# EAGLE design Adafruit NeoPixel Shield v2 (EAGLE 6.4)
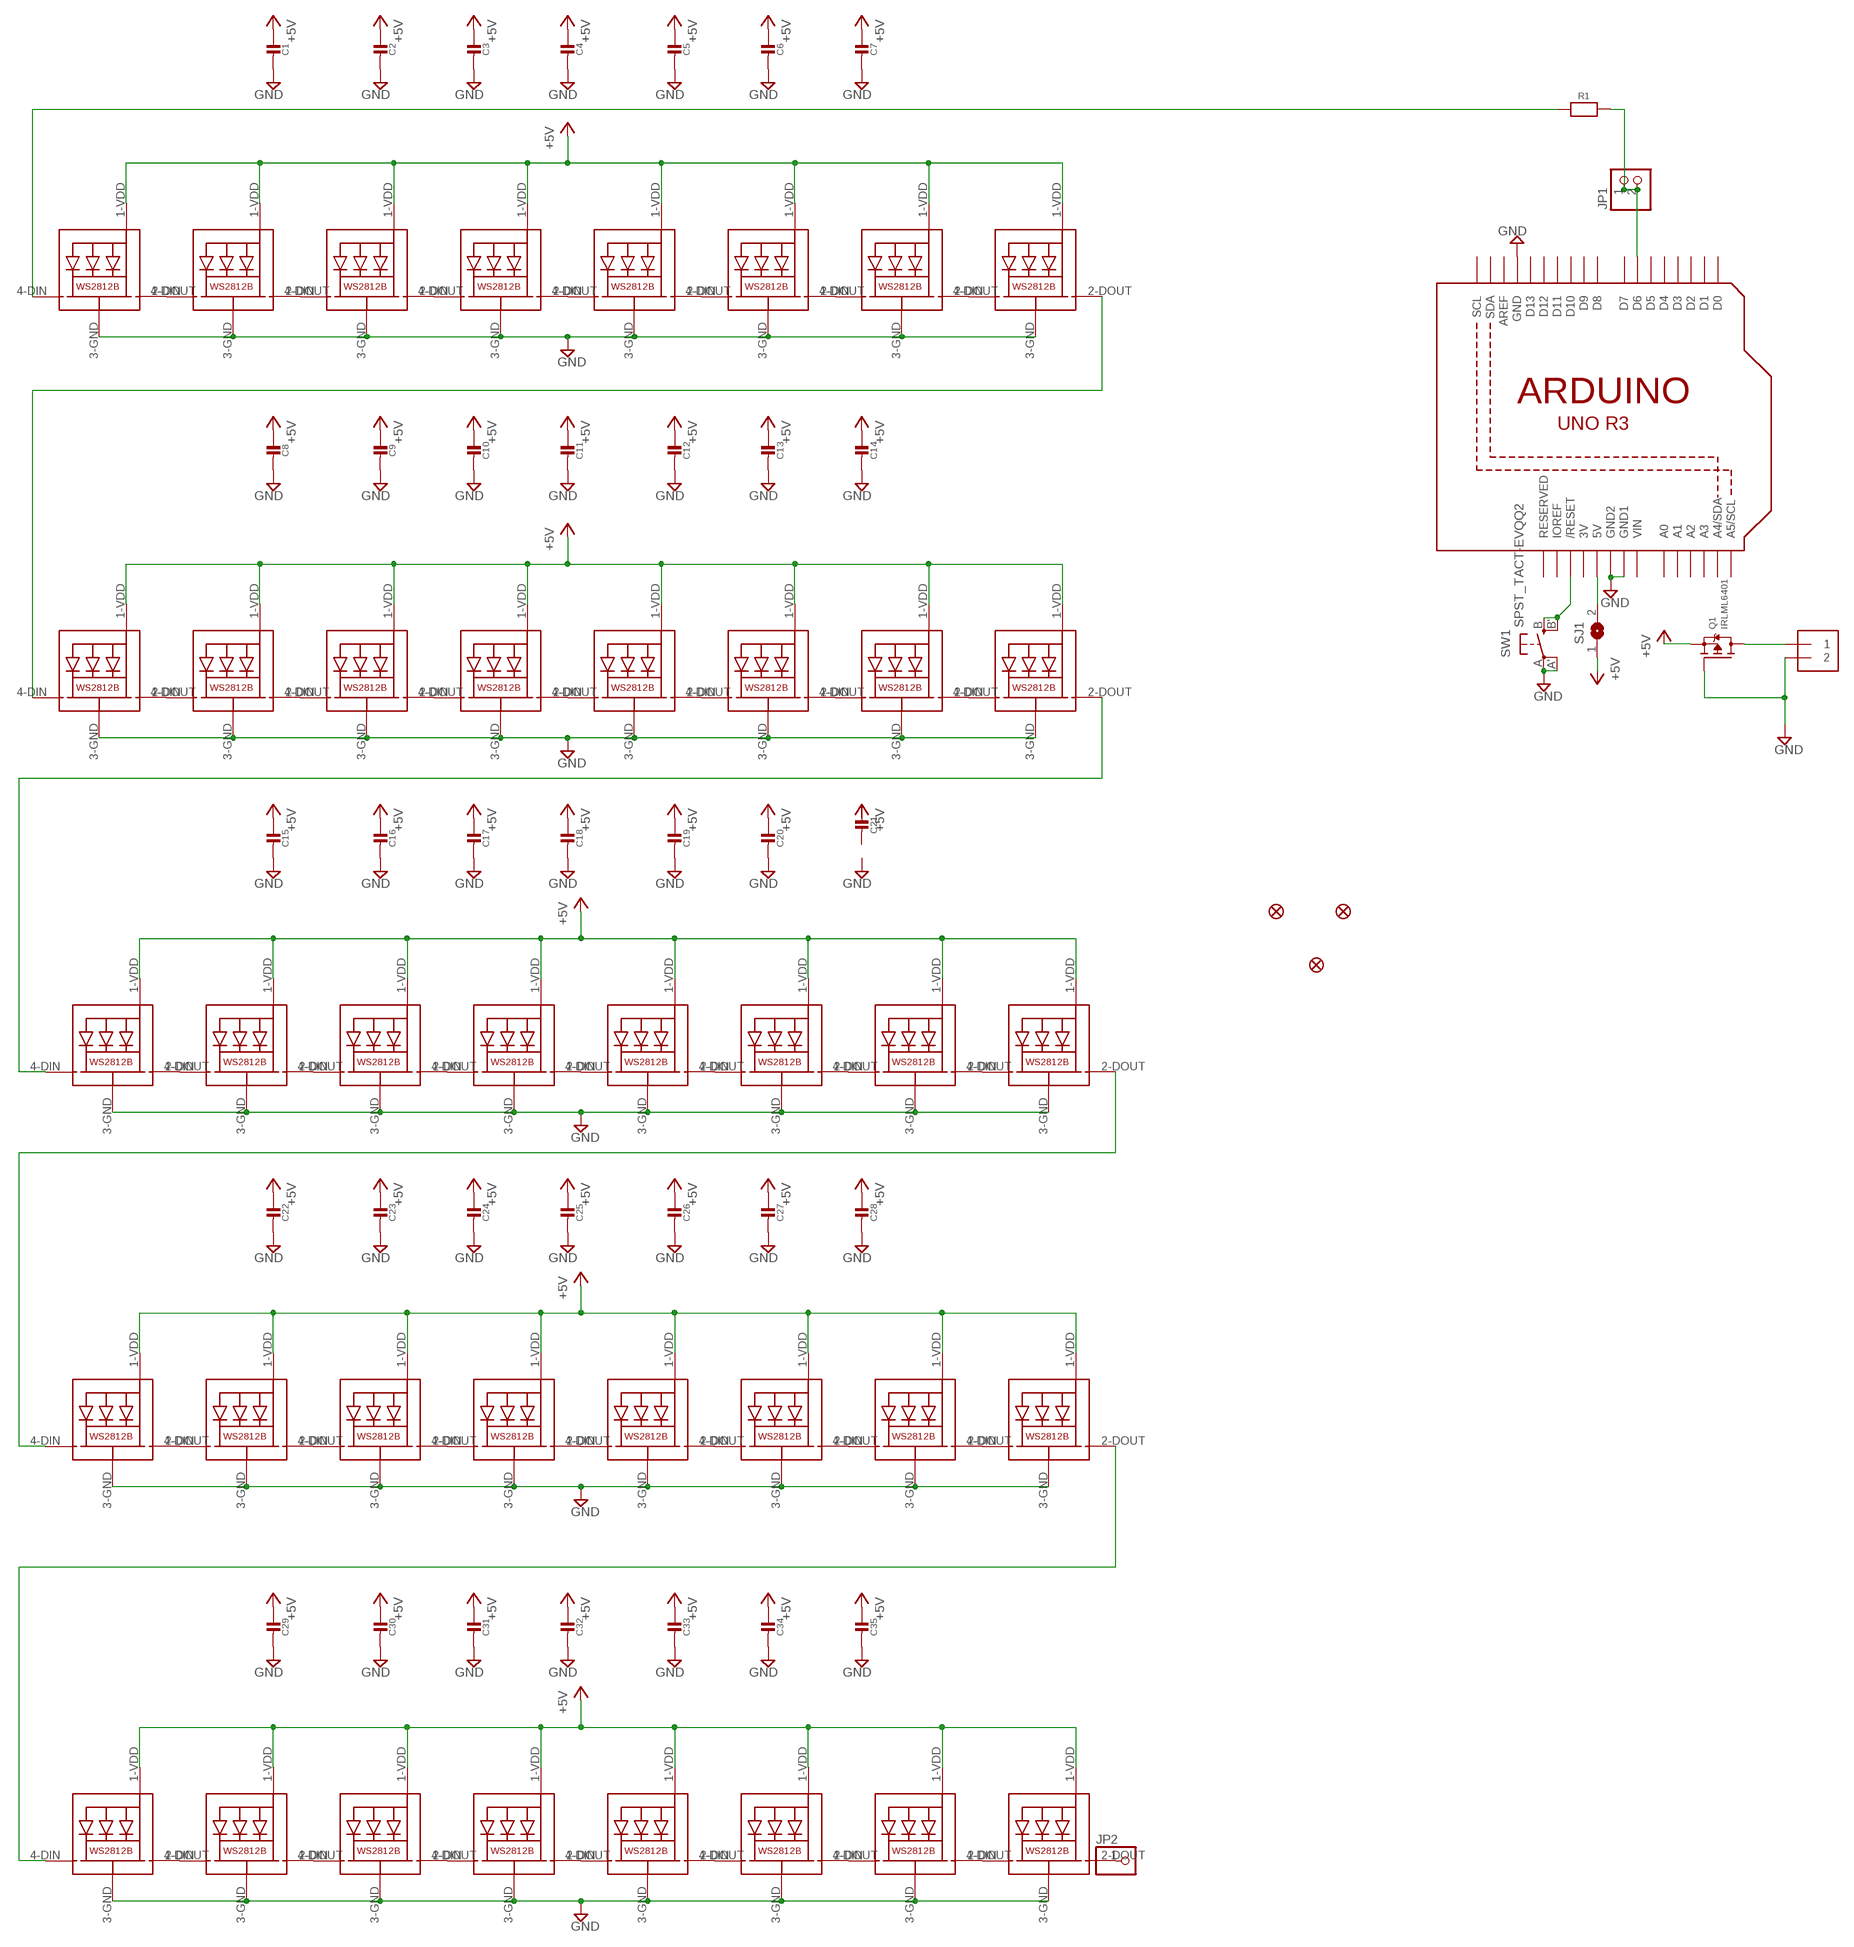
[diagram p0: schematic, sheet 1]

## Parts
C1  CAP_CERAMIC_0805NO  [_0805NO]
C2  CAP_CERAMIC_0805NO  [_0805NO]
C3  CAP_CERAMIC_0805NO  [_0805NO]
C4  CAP_CERAMIC_0805NO  [_0805NO]
C5  CAP_CERAMIC_0805NO  [_0805NO]
C6  CAP_CERAMIC_0805NO  [_0805NO]
C7  CAP_CERAMIC_0805NO  [_0805NO]
C8  CAP_CERAMIC_0805NO  [_0805NO]
C9  CAP_CERAMIC_0805NO  [_0805NO]
C10  CAP_CERAMIC_0805NO  [_0805NO]
C11  CAP_CERAMIC_0805NO  [_0805NO]
C12  CAP_CERAMIC_0805NO  [_0805NO]
C13  CAP_CERAMIC_0805NO  [_0805NO]
C14  CAP_CERAMIC_0805NO  [_0805NO]
C15  CAP_CERAMIC_0805NO  [_0805NO]
C16  CAP_CERAMIC_0805NO  [_0805NO]
C17  CAP_CERAMIC_0805NO  [_0805NO]
C18  CAP_CERAMIC_0805NO  [_0805NO]
C19  CAP_CERAMIC_0805NO  [_0805NO]
C20  CAP_CERAMIC_0805NO  [_0805NO]
C21  CAP_CERAMIC_0805NO  [_0805NO]
C22  CAP_CERAMIC_0805NO  [_0805NO]
C23  CAP_CERAMIC_0805NO  [_0805NO]
C24  CAP_CERAMIC_0805NO  [_0805NO]
C25  CAP_CERAMIC_0805NO  [_0805NO]
C26  CAP_CERAMIC_0805NO  [_0805NO]
C27  CAP_CERAMIC_0805NO  [_0805NO]
C28  CAP_CERAMIC_0805NO  [_0805NO]
C29  CAP_CERAMIC_0805NO  [_0805NO]
C30  CAP_CERAMIC_0805NO  [_0805NO]
C31  CAP_CERAMIC_0805NO  [_0805NO]
C32  CAP_CERAMIC_0805NO  [_0805NO]
C33  CAP_CERAMIC_0805NO  [_0805NO]
C34  CAP_CERAMIC_0805NO  [_0805NO]
C35  CAP_CERAMIC_0805NO  [_0805NO]
FID1  FIDUCIAL""  [FIDUCIAL_1MM]
FID2  FIDUCIAL""  [FIDUCIAL_1MM]
FID3  FIDUCIAL""  [FIDUCIAL_1MM]
J1  1X2-3.5MM  [1X2-3.5MM]
JP1  HEADER-1X2ROUND  [1X02_ROUND]
JP2  PINHD-1X1CB  [1X01-CLEANBIG]
LED1  WS2812B5050  [WS2812B]
LED2  WS2812B5050  [WS2812B]
LED3  WS2812B5050  [WS2812B]
LED4  WS2812B5050  [WS2812B]
LED5  WS2812B5050  [WS2812B]
LED6  WS2812B5050  [WS2812B]
LED7  WS2812B5050  [WS2812B]
LED8  WS2812B5050  [WS2812B]
LED9  WS2812B5050  [WS2812B]
LED10  WS2812B5050  [WS2812B]
LED11  WS2812B5050  [WS2812B]
LED12  WS2812B5050  [WS2812B]
LED13  WS2812B5050  [WS2812B]
LED14  WS2812B5050  [WS2812B]
LED15  WS2812B5050  [WS2812B]
LED16  WS2812B5050  [WS2812B]
LED17  WS2812B5050  [WS2812B]
LED18  WS2812B5050  [WS2812B]
LED19  WS2812B5050  [WS2812B]
LED20  WS2812B5050  [WS2812B]
LED21  WS2812B5050  [WS2812B]
LED22  WS2812B5050  [WS2812B]
LED23  WS2812B5050  [WS2812B]
LED24  WS2812B5050  [WS2812B]
LED25  WS2812B5050  [WS2812B]
LED26  WS2812B5050  [WS2812B]
LED27  WS2812B5050  [WS2812B]
LED28  WS2812B5050  [WS2812B]
LED29  WS2812B5050  [WS2812B]
LED30  WS2812B5050  [WS2812B]
LED31  WS2812B5050  [WS2812B]
LED32  WS2812B5050  [WS2812B]
LED33  WS2812B5050  [WS2812B]
LED34  WS2812B5050  [WS2812B]
LED35  WS2812B5050  [WS2812B]
LED36  WS2812B5050  [WS2812B]
LED37  WS2812B5050  [WS2812B]
LED38  WS2812B5050  [WS2812B]
LED39  WS2812B5050  [WS2812B]
LED40  WS2812B5050  [WS2812B]
Q1  IRLML6401  MOSFET-PWIDE  [SOT23-WIDE]
R1  RESISTOR_0805NO  [_0805NO]
SJ1  SOLDERJUMPERCLOSED  [SOLDERJUMPER_CLOSEDWIRE]
SW1  SPST_TACT-EVQQ2  [EVQ-Q2]
U1  ARDUINOR3-BPLACE  [ARDUINOR3-BPLACE]

## Nets
+5V: C1.1 C2.1 C3.1 C4.1 C5.1 C6.1 C7.1 C8.1 C9.1 C10.1 C11.1 C12.1 C13.1 C14.1 C15.1 C16.1 C17.1 C18.1 C19.1 C20.1 C21.1 C22.1 C23.1 C24.1 C25.1 C26.1 C27.1 C28.1 C29.1 C30.1 C31.1 C32.1 C33.1 C34.1 C35.1 LED1.1-VDD(VDD) LED2.1-VDD(VDD) LED3.1-VDD(VDD) LED4.1-VDD(VDD) LED5.1-VDD(VDD) LED6.1-VDD(VDD) LED7.1-VDD(VDD) LED8.1-VDD(VDD) LED9.1-VDD(VDD) LED10.1-VDD(VDD) LED11.1-VDD(VDD) LED12.1-VDD(VDD) LED13.1-VDD(VDD) LED14.1-VDD(VDD) LED15.1-VDD(VDD) LED16.1-VDD(VDD) LED17.1-VDD(VDD) LED18.1-VDD(VDD) LED19.1-VDD(VDD) LED20.1-VDD(VDD) LED21.1-VDD(VDD) LED22.1-VDD(VDD) LED23.1-VDD(VDD) LED24.1-VDD(VDD) LED25.1-VDD(VDD) LED26.1-VDD(VDD) LED27.1-VDD(VDD) LED28.1-VDD(VDD) LED29.1-VDD(VDD) LED30.1-VDD(VDD) LED31.1-VDD(VDD) LED32.1-VDD(VDD) LED33.1-VDD(VDD) LED34.1-VDD(VDD) LED35.1-VDD(VDD) LED36.1-VDD(VDD) LED37.1-VDD(VDD) LED38.1-VDD(VDD) LED39.1-VDD(VDD) LED40.1-VDD(VDD) Q1.2(S) SJ1.1
GND: C1.2 C2.2 C3.2 C4.2 C5.2 C6.2 C7.2 C8.2 C9.2 C10.2 C11.2 C12.2 C13.2 C14.2 C15.2 C16.2 C17.2 C18.2 C19.2 C20.2 C21.2 C22.2 C23.2 C24.2 C25.2 C26.2 C27.2 C28.2 C29.2 C30.2 C31.2 C32.2 C33.2 C34.2 C35.2 J1.2 LED1.3-GND(GND) LED2.3-GND(GND) LED3.3-GND(GND) LED4.3-GND(GND) LED5.3-GND(GND) LED6.3-GND(GND) LED7.3-GND(GND) LED8.3-GND(GND) LED9.3-GND(GND) LED10.3-GND(GND) LED11.3-GND(GND) LED12.3-GND(GND) LED13.3-GND(GND) LED14.3-GND(GND) LED15.3-GND(GND) LED16.3-GND(GND) LED17.3-GND(GND) LED18.3-GND(GND) LED19.3-GND(GND) LED20.3-GND(GND) LED21.3-GND(GND) LED22.3-GND(GND) LED23.3-GND(GND) LED24.3-GND(GND) LED25.3-GND(GND) LED26.3-GND(GND) LED27.3-GND(GND) LED28.3-GND(GND) LED29.3-GND(GND) LED30.3-GND(GND) LED31.3-GND(GND) LED32.3-GND(GND) LED33.3-GND(GND) LED34.3-GND(GND) LED35.3-GND(GND) LED36.3-GND(GND) LED37.3-GND(GND) LED38.3-GND(GND) LED39.3-GND(GND) LED40.3-GND(GND) Q1.1(G) SW1.A'(P1) SW1.A(P) U1.GND U1.GND1 U1.GND2
N$1: LED1.2-DOUT(DO) LED2.4-DIN(DI)
N$2: LED2.2-DOUT(DO) LED3.4-DIN(DI)
N$3: LED3.2-DOUT(DO) LED4.4-DIN(DI)
N$4: LED4.2-DOUT(DO) LED5.4-DIN(DI)
N$5: LED5.2-DOUT(DO) LED6.4-DIN(DI)
N$6: LED6.2-DOUT(DO) LED7.4-DIN(DI)
N$7: LED7.2-DOUT(DO) LED8.4-DIN(DI)
N$8: LED9.2-DOUT(DO) LED10.4-DIN(DI)
N$9: LED10.2-DOUT(DO) LED11.4-DIN(DI)
N$10: LED11.2-DOUT(DO) LED12.4-DIN(DI)
N$11: LED12.2-DOUT(DO) LED13.4-DIN(DI)
N$12: LED13.2-DOUT(DO) LED14.4-DIN(DI)
N$13: LED14.2-DOUT(DO) LED15.4-DIN(DI)
N$14: LED15.2-DOUT(DO) LED16.4-DIN(DI)
N$15: LED8.2-DOUT(DO) LED9.4-DIN(DI)
N$16: LED17.2-DOUT(DO) LED18.4-DIN(DI)
N$17: LED18.2-DOUT(DO) LED19.4-DIN(DI)
N$18: LED19.2-DOUT(DO) LED20.4-DIN(DI)
N$19: LED20.2-DOUT(DO) LED21.4-DIN(DI)
N$20: LED21.2-DOUT(DO) LED22.4-DIN(DI)
N$21: LED22.2-DOUT(DO) LED23.4-DIN(DI)
N$22: LED23.2-DOUT(DO) LED24.4-DIN(DI)
N$23: LED16.2-DOUT(DO) LED17.4-DIN(DI)
N$24: LED25.2-DOUT(DO) LED26.4-DIN(DI)
N$25: LED26.2-DOUT(DO) LED27.4-DIN(DI)
N$26: LED27.2-DOUT(DO) LED28.4-DIN(DI)
N$27: LED28.2-DOUT(DO) LED29.4-DIN(DI)
N$28: LED29.2-DOUT(DO) LED30.4-DIN(DI)
N$29: LED30.2-DOUT(DO) LED31.4-DIN(DI)
N$30: LED31.2-DOUT(DO) LED32.4-DIN(DI)
N$31: LED24.2-DOUT(DO) LED25.4-DIN(DI)
N$32: LED33.2-DOUT(DO) LED34.4-DIN(DI)
N$33: LED34.2-DOUT(DO) LED35.4-DIN(DI)
N$34: LED35.2-DOUT(DO) LED36.4-DIN(DI)
N$35: LED36.2-DOUT(DO) LED37.4-DIN(DI)
N$36: LED37.2-DOUT(DO) LED38.4-DIN(DI)
N$37: LED38.2-DOUT(DO) LED39.4-DIN(DI)
N$38: LED39.2-DOUT(DO) LED40.4-DIN(DI)
N$39: LED32.2-DOUT(DO) LED33.4-DIN(DI)
N$40: SW1.B'(S1) SW1.B(S) U1.RESET(/RESET)
N$41: SJ1.2 U1.5V
N$42: JP2.1 LED40.2-DOUT(DO)
N$43: LED1.4-DIN(DI) R1.1
N$44: JP1.1 JP1.2 R1.2 U1.D6
PWRIN: J1.1 Q1.3(D)
Unconnected: U1.A0 U1.A1 U1.A2 U1.A3 U1.A4(A4/SDA) U1.A5(A5/SCL) U1.AREF U1.D0 U1.D1 U1.D2 U1.D3 U1.D4 U1.D5 U1.D7 U1.D8 U1.D9 U1.D10 U1.D11 U1.D12 U1.D13 U1.IOREF U1.RESERVED U1.SCL U1.SDA

## Power pins joined to a net without a drawn wire
3V: U1.3V
VIN: U1.VIN

## Library data of the parts
C1-C35 = microbuilder:CAP_CERAMIC: Ceramic Capacitors For new designs, use the packages preceded by an '_' character since they are more reliable: The following footprints should be used on most boards: _0402 - Standard footprint for regular board layouts _0603 - Standard footprint for regular board layouts _0805 - Standard footprint for regular board layouts _1206 - Standard footprint for regular board layouts For extremely tight-pitch boards where space is at a premium, the following 'micro-pitch' footprints can be used (smaller pads, no silkscreen outline, etc.): _0402MP - Micro-pitch footprint for very dense/compact boards _0603MP - Micro-pitch footprint for very dense/compact boards _0805MP - Micro-pitch footprint for very dense/compact boards _1206MP - Micro-pitch footprint for very dense/compact boards
FID1-FID3 = microbuilder:FIDUCIAL: Fiducial Alignment Points Various fiducial points for machine vision alignment.; BOM: EXCLUDE
J1 = adafruit:1X2: 3.5mm Terminal block http://www.ladyada.net/library/pcb/eaglelibrary.html
JP1 = microbuilder:HEADER-1X2: PIN HEADER
JP2 = adafruit:PINHD-1X1: Pin header 1x1 for 0.1" spacing With round pins
LED1-LED40 = microbuilder:WS2812B5050
Q1 = microbuilder:MOSFET-P: P-Channel Mosfet LEGEND VDS: Voltage Drain-Source ID: Drain Current RDS(ON): Drain-Source On-State Resistance VGS(TH): Gate-Source Threshold Voltage CISS: Drain-Source Input Capacitance SOT-23 Name VDS ID RDS(ON) VGS(TH) CISS Order Number IRLML5103 30V 760mA 600 mOhm -- 75pF @ 25V Digikey: IRLML5103PBFCT-ND NTR0202PL 20V 400mA 800 mOhm 2.3V @ 250uA 70pF @ 5V Digikey: NTR0202PLT1GOSTR-ND NTR4101PT1G 20V 1.8A 85 mOhm 1.2V @ 250uA 675pF @ 10V Digikey: NTR4101PT1GOSCT-ND DMP2004K 20V 600mA 900 mOhm 1V @ 250uA 175pF @ 16V Digikey: DMP2004KDICT-ND PMV65XP 20V 3.9A 76 mOhm 950mV @ 1mA 725pF @ 20V Digikey: 568-2358-2-ND TO-252 Name VDS ID RDS(ON) VGS(TH) CISS Order Number AOD417 30V 25A 34 mOhm 3V @ 250µA 920pF @ 15V Digikey: 785-1106-2-ND
R1 = microbuilder:RESISTOR: Resistors For new designs, use the packages preceded by an '_' character since they are more reliable: The following footprints should be used on most boards: _0402 - Standard footprint for regular board layouts _0603 - Standard footprint for regular board layouts _0805 - Standard footprint for regular board layouts _1206 - Standard footprint for regular board layouts For extremely tight-pitch boards where space is at a premium, the following 'micro-pitch' footprints can be used (smaller pads, no silkscreen outline, etc.): _0402MP - Micro-pitch footprint for very dense/compact boards _0603MP - Micro-pitch footprint for very dense/compact boards _0805MP - Micro-pitch footprint for very dense/compact boards _1206MP - Micro-pitch footprint for very dense/compact boards
SJ1 = microbuilder:SOLDERJUMPER: SMD Solder JUMPER Solder the two pads together to create a connection, or remove the solder to break it. REFLOW - Use this footprint for solder paste and reflow ovens. WAVE - Use this footprint for hand-soldering (larger pads). CLOSED - Has a trace between the two pads to ensure it is closed by default. The trace needs to be cut to disable the jumper, and can be closed again by creating a solder bridge between the two pads.
SW1 = adafruit:SPST_TACT: SMT 6mm switch, EVQQ2 series http://www.ladyada.net/library/eagle
U1 = adafruit:ARDUINOR3: This is a new object for the new Arduino R3 - with extra pins that you may want to use (such as IOref, and duplicated A4/A5

## Board
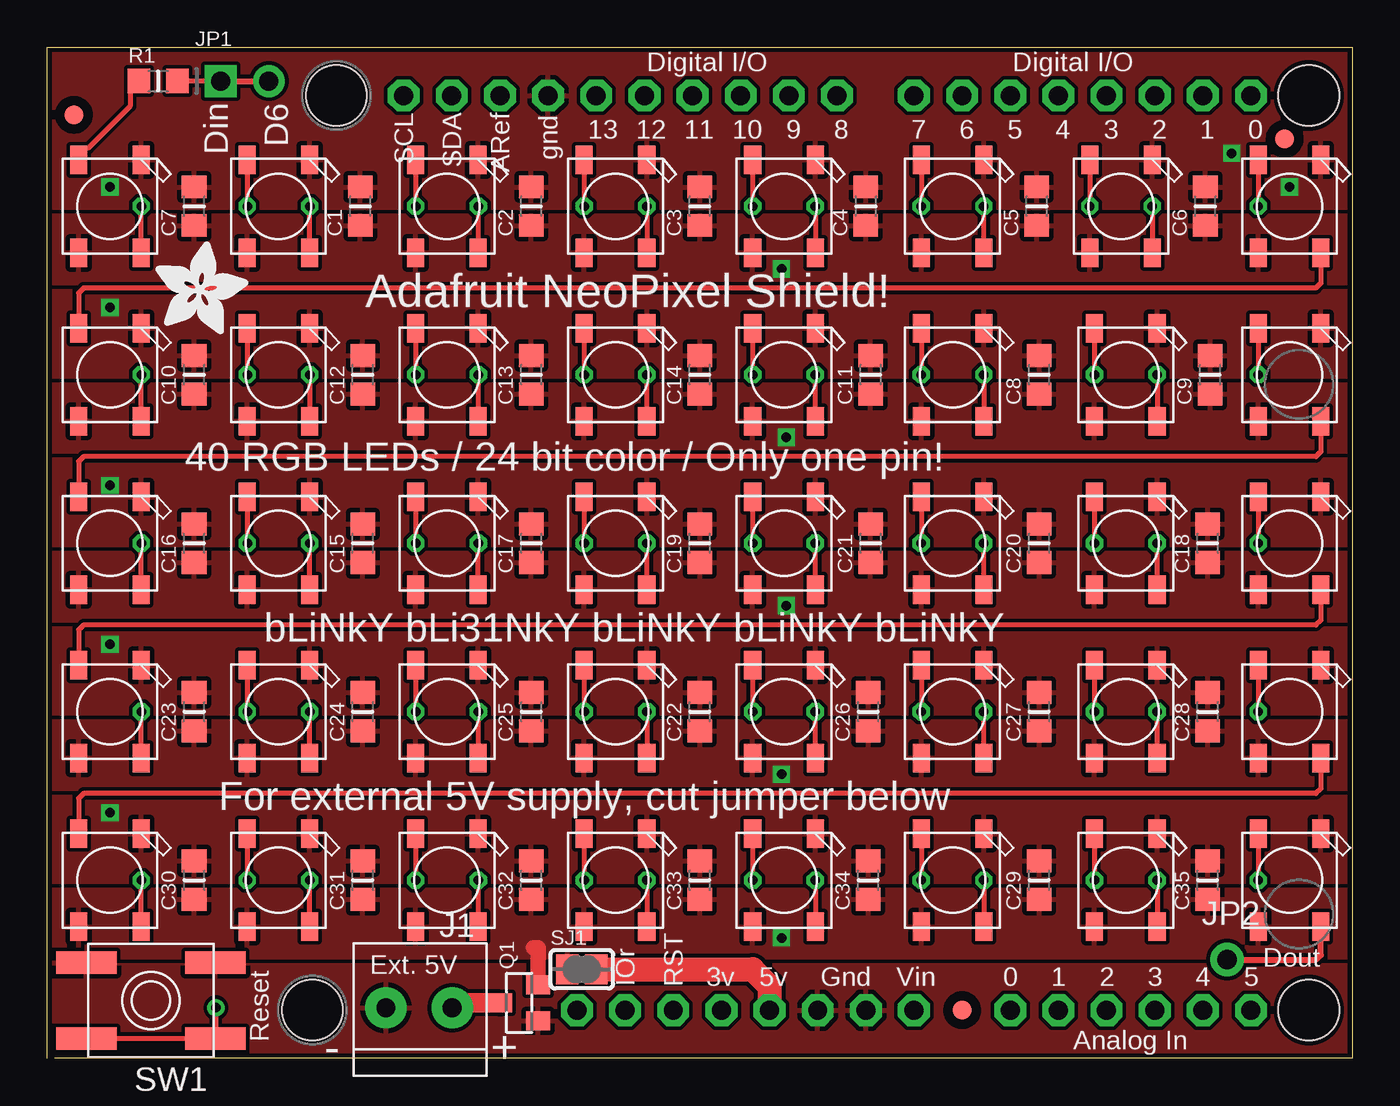
[diagram p1: board, top side]
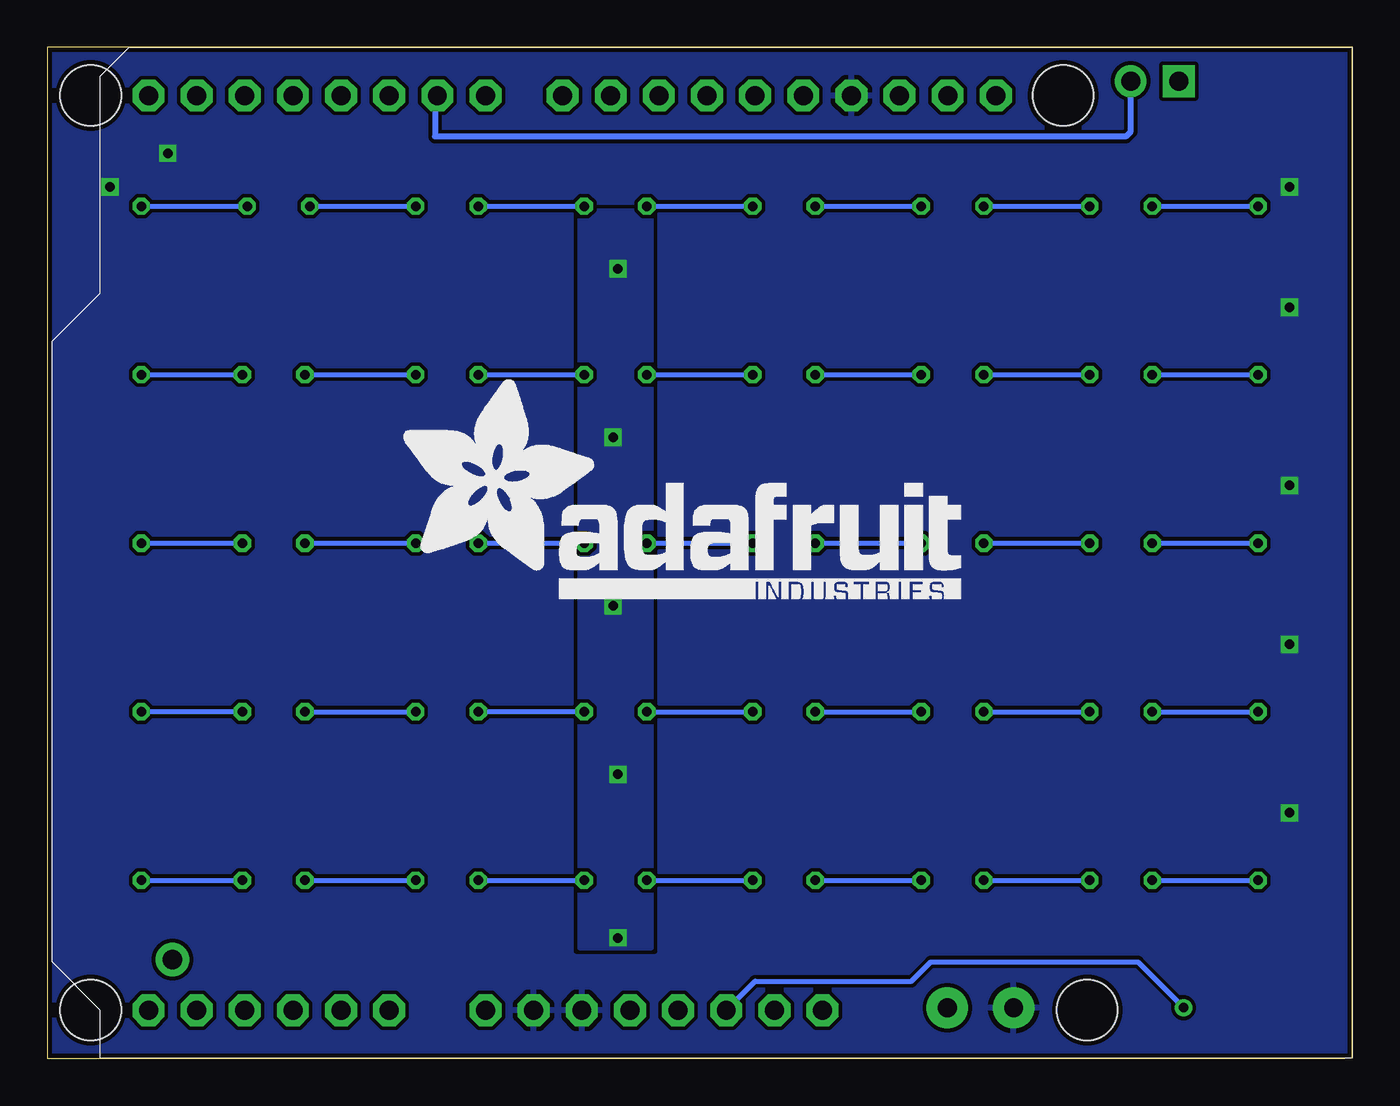
[diagram p2: board, bottom side, seen from below]

Size 68.83 x 53.34 mm. Coordinates in mm from the lower left corner, seen from the top.
Outline: 0,0 0,53.34 68.83,53.34 68.83,0 0.38,0
Copper layers (1*16): Top 0.035mm / dielectric 1.5mm / Bottom 0.035mm
Design rules "adafruit *": minimum track width 8mil, minimum drill 15.5mil, track to track 8mil, track to pad 8mil, pad to pad 8mil, via to via 8mil, smd to smd 8mil, copper to edge 10mil, drill to drill 8mil, minimum pad ring 10mil, minimum via ring 8mil, stop-mask expansion 4mil, vias tented up to drill 25mil, thermal gap 10mil
Holes 3.2 mm at 15.24,50.8 13.97,2.54 66.55,50.8 66.55,2.54

### Footprints (pad centres in the part's own frame; a part is rotated, then mirrored left to right if it is on the bottom)
_0805NO = smd 1.2 x 1.3: 1 -1.016,0; 2 1.016,0
FIDUCIAL_1MM = smd 1 x 1: 1 0,0
1X2-3.5MM = drill 1 pad 2.184: 1 1.8,0; 2 -1.7,0
1X02_ROUND = drill 1 pad 1.676 square: 1 -1.27,0 | drill 1 pad 1.676: 2 1.27,0
1X01-CLEANBIG = drill 1.016 pad 1.778: 1 0,0
WS2812B = smd 1.5 x 0.9: 1-VDD 2.45,-1.65; 2-DOUT 2.45,1.65; 3-GND -2.45,1.65; 4-DIN -2.45,-1.65
SOT23-WIDE = smd 1 x 1.27: 1 -0.95,-1; 2 0.95,-1; 3 0,1
SOLDERJUMPER_CLOSEDWIRE = smd 1.168 x 1.6: 1 -0.762,0; 2 0.762,0 | smd 0.635 x 0.203: WIRE 0,0
EVQ-Q2 = smd 3.2 x 1.2: A -3.4,-2; A' 3.4,-2; B -3.4,2; B' 3.4,2
ARDUINOR3-BPLACE = drill 1 pad 1.676 octagon: 3V 35.56,2.54; 5V 38.1,2.54; A0 50.8,2.54; A1 53.34,2.54; A2 55.88,2.54; A3 58.42,2.54; A4 60.96,2.54; A5 63.5,2.54; AREF 23.876,50.8; D0 63.5,50.8; D1 60.96,50.8; D2 58.42,50.8; D3 55.88,50.8; D4 53.34,50.8; D5 50.8,50.8; D6 48.26,50.8; D7 45.72,50.8; D8 41.656,50.8; D9 39.116,50.8; D10 36.576,50.8; D11 34.036,50.8; D12 31.496,50.8; D13 28.956,50.8; GND 26.416,50.8; GND1 43.18,2.54; GND2 40.64,2.54; IOREF 30.48,2.54; RESERVED 27.94,2.54; RESET 33.02,2.54; SCL 18.796,50.8; SDA 21.336,50.8; VIN 45.72,2.54

### Placement (x,y rotation side)
C1  16.51,44.96 90 top
C2  25.53,44.96 90 top
C3  34.42,44.96 90 top
C4  43.18,44.96 90 top
C5  52.2,44.96 90 top
C6  61.09,44.96 90 top
C7  7.75,44.96 90 top
C8  52.32,36.07 90 top
C9  61.34,36.07 90 top
C10  7.75,36.07 90 top
C11  43.43,36.07 90 top
C12  16.64,36.07 90 top
C13  25.53,36.07 90 top
C14  34.42,36.07 90 top
C15  16.64,27.18 90 top
C16  7.75,27.18 90 top
C17  25.53,27.18 90 top
C18  61.21,27.18 90 top
C19  34.42,27.18 90 top
C20  52.32,27.18 90 top
C21  43.43,27.18 90 top
C22  34.42,18.29 90 top
C23  7.75,18.29 90 top
C24  16.64,18.29 90 top
C25  25.53,18.29 90 top
C26  43.31,18.29 90 top
C27  52.32,18.29 90 top
C28  61.21,18.29 90 top
C29  52.32,9.4 90 top
C30  7.75,9.4 90 top
C31  16.64,9.4 90 top
C32  25.53,9.4 90 top
C33  34.42,9.4 90 top
C34  43.31,9.4 90 top
C35  61.21,9.4 90 top
FID1  48.26,2.54 0 top
FID2  1.4,49.78 0 top
FID3  65.28,48.51 0 top
J1  19.56,2.67 0 top
JP1  10.41,51.56 0 top
JP2  62.23,5.21 0 top
LED1  3.3,44.96 270 top
LED2  12.19,44.96 270 top
LED3  21.08,44.96 270 top
LED4  29.97,44.96 270 top
LED5  38.86,44.96 270 top
LED6  47.75,44.96 270 top
LED7  56.64,44.96 270 top
LED8  65.53,44.96 270 top
LED9  3.3,36.07 270 top
LED10  12.19,36.07 270 top
LED11  21.08,36.07 270 top
LED12  29.97,36.07 270 top
LED13  38.86,36.07 270 top
LED14  47.75,36.07 270 top
LED15  56.9,36.07 270 top
LED16  65.53,36.07 270 top
LED17  3.3,27.18 270 top
LED18  12.19,27.18 270 top
LED19  21.08,27.18 270 top
LED20  29.97,27.18 270 top
LED21  38.86,27.18 270 top
LED22  47.75,27.18 270 top
LED23  56.9,27.18 270 top
LED24  65.53,27.18 270 top
LED25  3.3,18.29 270 top
LED26  12.19,18.29 270 top
LED27  21.08,18.29 270 top
LED28  29.97,18.29 270 top
LED29  38.86,18.29 270 top
LED30  47.75,18.29 270 top
LED31  56.9,18.29 270 top
LED32  65.53,18.29 270 top
LED33  3.3,9.4 270 top
LED34  12.19,9.4 270 top
LED35  21.08,9.4 270 top
LED36  29.97,9.4 270 top
LED37  38.86,9.4 270 top
LED38  47.75,9.4 270 top
LED39  56.9,9.4 270 top
LED40  65.53,9.4 270 top
Q1  24.89,2.92 90 top
R1  5.84,51.56 0 top
SJ1  28.19,4.7 0 top
SW1  5.46,3.05 180 top
U1  0,0 0 top
U$1  [ADAFRUIT_5MM]  5.71,38.23 0 top
U$2  [ADAFRUIT_TEXT_30MM]  50.29,24.26 0 bottom

### Tracks (layer width: path | path; a pad name or v marks a point on that pad's centre or on a via)
+5V  (via drill 0.5)
  Top 0.813: Q1.2 25.89,5.84 25.65,5.84
  other vias: 38.73,41.66 38.99,32.77 38.99,23.88 38.73,14.99 38.73,6.35
  pour Top: 0,44.45 68.83,44.45 68.83,40.89 0,40.89
  pour Top: 0,35.56 68.83,35.56 68.83,32 0,32
  pour Top: 0,26.67 68.83,26.67 68.83,23.11 0,23.11
  pour Top: 0,17.78 68.83,17.78 68.83,14.22 0,14.22
  pour Top: 0.25,8.89 69.09,8.89 69.09,5.33 0.25,5.33
  pour Bottom: 36.96,44.7 40.77,44.7 40.77,5.84 36.96,5.84
GND  (via drill 0.5)
  other vias: 3.3,12.95 3.3,21.84 3.3,30.23 3.3,39.62 3.3,45.97 65.53,45.97 62.48,47.75
  pour Bottom (rank 2): -0.25,53.21 -0.25,-0.13 68.58,0 68.58,53.34
  pour Top (rank 2): 0,53.34 68.83,53.34 68.83,0 0,0
N$1  (via drill 0.5)
  Top 0.254: LED1.2-DOUT v4.95,44.96 | LED2.4-DIN v10.54,44.96
  Bottom 0.254: v10.54,44.96 v4.95,44.96
N$2  (via drill 0.5)
  Top 0.254: LED2.2-DOUT v13.84,44.96 | LED3.4-DIN v19.43,44.96
  Bottom 0.254: v19.43,44.96 v13.84,44.96
N$3  (via drill 0.5)
  Top 0.254: LED4.4-DIN v28.32,44.96 | v22.73,44.96 LED3.2-DOUT
  Bottom 0.254: v28.32,44.96 v22.73,44.96
N$4  (via drill 0.5)
  Top 0.254: LED5.4-DIN v37.21,44.96 | v31.62,44.96 LED4.2-DOUT
  Bottom 0.254: v37.21,44.96 v31.62,44.96
N$5  (via drill 0.5)
  Top 0.254: LED6.4-DIN v46.1,44.96 | v40.51,44.96 LED5.2-DOUT
  Bottom 0.254: v46.1,44.96 v40.51,44.96
N$6  (via drill 0.5)
  Top 0.254: LED6.2-DOUT v49.4,44.96 | LED7.4-DIN v54.99,44.96
  Bottom 0.254: v54.99,44.96 v49.4,44.96
N$7  (via drill 0.5)
  Top 0.254: LED8.4-DIN v63.88,44.96 | v58.29,44.96 LED7.2-DOUT
  Bottom 0.254: v63.88,44.96 v58.29,44.96
N$8  (via drill 0.5)
  Top 0.254: LED9.2-DOUT v4.95,36.07 | LED10.4-DIN v10.54,36.07
  Bottom 0.254: v10.54,36.07 v4.95,36.07
N$9  (via drill 0.5)
  Top 0.254: v13.84,36.07 LED10.2-DOUT | LED11.4-DIN v19.43,36.07
  Bottom 0.254: v19.43,36.07 v13.84,36.07
N$10  (via drill 0.5)
  Top 0.254: v22.73,36.07 LED11.2-DOUT | LED12.4-DIN v28.32,36.07
  Bottom 0.254: v28.32,36.07 v22.73,36.07
N$11  (via drill 0.5)
  Top 0.254: LED12.2-DOUT v31.62,36.07 | LED13.4-DIN v37.21,36.07
  Bottom 0.254: v37.21,36.07 v31.62,36.07
N$12  (via drill 0.5)
  Top 0.254: LED13.2-DOUT v40.51,36.07 | LED14.4-DIN v46.1,36.07
  Bottom 0.254: v46.1,36.07 v40.51,36.07
N$13  (via drill 0.5)
  Top 0.254: v49.4,36.07 LED14.2-DOUT | LED15.4-DIN v55.25,36.07
  Bottom 0.254: v55.25,36.07 v49.4,36.07
N$14  (via drill 0.5)
  Top 0.254: v58.55,36.07 LED15.2-DOUT | LED16.4-DIN v63.88,36.07
  Bottom 0.254: v63.88,36.07 v58.55,36.07
N$15
  Top 0.254: LED8.2-DOUT 67.18,40.89 66.93,40.64 1.91,40.64 1.65,40.39 LED9.4-DIN
N$16  (via drill 0.5)
  Top 0.254: LED17.2-DOUT v4.95,27.18 | LED18.4-DIN v10.54,27.18
  Bottom 0.254: v10.54,27.18 v4.95,27.18
N$17  (via drill 0.5)
  Top 0.254: LED18.2-DOUT v13.84,27.18 | LED19.4-DIN v19.43,27.18
  Bottom 0.254: v19.43,27.18 v13.84,27.18
N$18  (via drill 0.5)
  Top 0.254: LED19.2-DOUT v22.73,27.18 | LED20.4-DIN v28.32,27.18
  Bottom 0.254: v28.32,27.18 v22.73,27.18
N$19  (via drill 0.5)
  Top 0.254: LED20.2-DOUT v31.62,27.18 | LED21.4-DIN v37.21,27.18
  Bottom 0.254: v37.21,27.18 v31.62,27.18
N$20  (via drill 0.5)
  Top 0.254: LED21.2-DOUT v40.51,27.18 | LED22.4-DIN v46.1,27.18
  Bottom 0.254: v46.1,27.18 v40.51,27.18
N$21  (via drill 0.5)
  Top 0.254: LED22.2-DOUT v49.4,27.18 | LED23.4-DIN v55.25,27.18
  Bottom 0.254: v55.25,27.18 v49.4,27.18
N$22  (via drill 0.5)
  Top 0.254: LED23.2-DOUT v58.55,27.18 | LED24.4-DIN v63.88,27.18
  Bottom 0.254: v63.88,27.18 v58.55,27.18
N$23
  Top 0.254: LED17.4-DIN 1.65,31.5 1.91,31.75 66.93,31.75 67.18,32 LED16.2-DOUT
N$24  (via drill 0.5)
  Top 0.254: LED25.2-DOUT v4.95,18.29 | LED26.4-DIN v10.54,18.29
  Bottom 0.254: v10.54,18.29 v4.95,18.29
N$25  (via drill 0.5)
  Top 0.254: LED26.2-DOUT v13.84,18.29 | LED27.4-DIN v19.43,18.29
  Bottom 0.254: v19.43,18.29 v13.84,18.29
N$26  (via drill 0.5)
  Top 0.254: v22.73,18.29 LED27.2-DOUT | LED28.4-DIN v28.32,18.29
  Bottom 0.254: v28.32,18.29 v22.73,18.29
N$27  (via drill 0.5)
  Top 0.254: v31.62,18.29 LED28.2-DOUT | LED29.4-DIN v37.21,18.29
  Bottom 0.254: v37.21,18.29 v31.62,18.29
N$28  (via drill 0.5)
  Top 0.254: LED30.4-DIN v46.1,18.29 | LED29.2-DOUT v40.51,18.29
  Bottom 0.254: v40.51,18.29 v46.1,18.29
N$29  (via drill 0.5)
  Top 0.254: LED30.2-DOUT v49.4,18.29 | LED31.4-DIN v55.25,18.29
  Bottom 0.254: v55.25,18.29 v49.4,18.29
N$30  (via drill 0.5)
  Top 0.254: LED31.2-DOUT v58.55,18.29 | LED32.4-DIN v63.88,18.29
  Bottom 0.254: v58.55,18.29 v63.88,18.29
N$31
  Top 0.254: LED24.2-DOUT 67.18,23.11 66.93,22.86 1.91,22.86 1.65,22.61 LED25.4-DIN
N$32  (via drill 0.5)
  Top 0.254: LED33.2-DOUT v4.95,9.4 | LED34.4-DIN v10.54,9.4
  Bottom 0.254: v10.54,9.4 v4.95,9.4
N$33  (via drill 0.5)
  Top 0.254: LED34.2-DOUT v13.84,9.4 | LED35.4-DIN v19.43,9.4
  Bottom 0.254: v19.43,9.4 v13.84,9.4
N$34  (via drill 0.5)
  Top 0.254: v22.73,9.4 LED35.2-DOUT | LED36.4-DIN v28.32,9.4
  Bottom 0.254: v28.32,9.4 v22.73,9.4
N$35  (via drill 0.5)
  Top 0.254: v31.62,9.4 LED36.2-DOUT | LED37.4-DIN v37.21,9.4
  Bottom 0.254: v37.21,9.4 v31.62,9.4
N$36  (via drill 0.5)
  Top 0.254: v40.51,9.4 LED37.2-DOUT | LED38.4-DIN v46.1,9.4
  Bottom 0.254: v46.1,9.4 v40.51,9.4
N$37  (via drill 0.5)
  Top 0.254: v49.4,9.4 LED38.2-DOUT | LED39.4-DIN v55.25,9.4
  Bottom 0.254: v55.25,9.4 v49.4,9.4
N$38  (via drill 0.5)
  Top 0.254: v58.55,9.4 LED39.2-DOUT | LED40.4-DIN v63.88,9.4
  Bottom 0.254: v63.88,9.4 v58.55,9.4
N$39
  Top 0.254: LED32.2-DOUT 67.18,14.22 66.93,13.97 1.91,13.97 1.65,13.72 LED33.4-DIN
N$40  (via drill 0.5)
  Top 0.254: SW1.B' SW1.B 8.89,1.08 v8.89,2.67
  Bottom 0.254: U1.RESET 31.5,4.06 23.24,4.06 22.23,5.08 11.3,5.08 v8.89,2.67
N$41
  Top 1.27: SJ1.2 37.21,4.7 38.1,3.81 U1.5V
N$42
  Top 0.305: JP2.1 66.93,5.21 67.18,5.46 LED40.2-DOUT
N$43
  Top 0.254: R1.1 4.83,51.51 4.37,51.05 4.37,50.24 2.16,48.03 1.65,48.03 LED1.4-DIN
N$44
  Top 0.254: JP1.1 R1.2
  Top 0.305: JP1.1 JP1.2
  Bottom 0.305: U1.D6 48.39,50.8 48.39,48.64 11.94,48.64 11.68,48.9 JP1.2
PWRIN
  Top 1.016: Q1.3 21.61,2.92 J1.1

### Text on the board
tPlace: Din | D6 | Adafruit NeoPixel Shield! | 40 RGB LEDs / 24 bit color / Only one pin! | bLiNkY bLi31NkY bLiNkY bLiNkY bLiNkY | For external 5V supply, cut jumper below | Dout | Ext. 5V | Reset | - | +